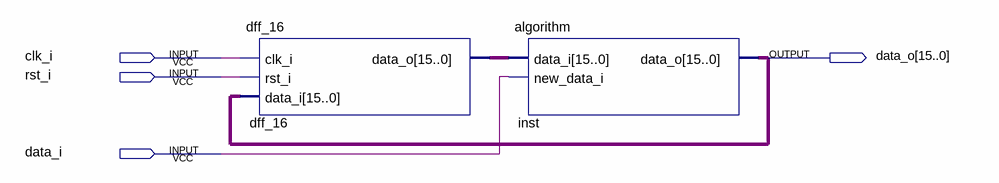
[diagram p0: schematic sheet]
// Quartus schematic crc_16_ansi.bdf as structural Verilog: 2 symbols, 4 pins
module crc_16_ansi (
  input  clk_i,
  input  rst_i,
  input  data_i,
  output [15:0] data_o
);

  wire [15:0] dff_16_data_o;

  dff_16 dff_16 (.clk_i(clk_i), .rst_i(rst_i), .data_i(data_o), .data_o(dff_16_data_o));
  algorithm inst (.data_i(dff_16_data_o), .new_data_i(data_i), .data_o(data_o));
endmodule
